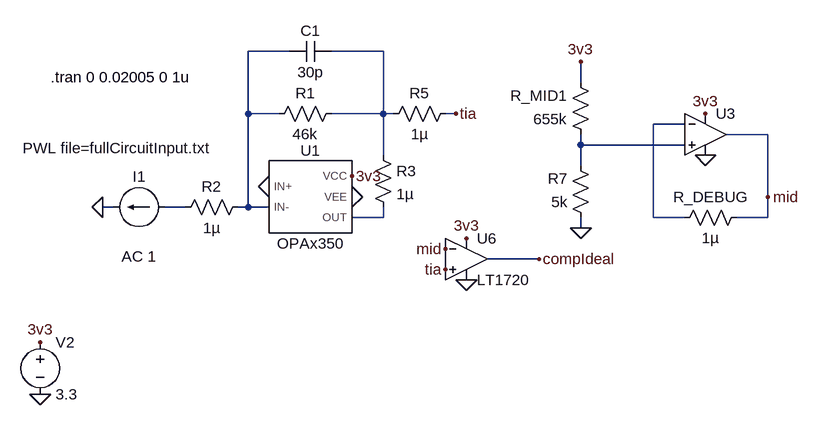
[diagram p0: schematic circuit_Simple.asc]
circuit_Simple.asc, the LTspice schematic file:
Version 4.1
SHEET 1 3920 1676
WIRE 2352 800 2288 800
WIRE 2496 800 2416 800
WIRE 2800 848 2800 816
WIRE 2288 896 2288 800
WIRE 2336 896 2288 896
WIRE 2496 896 2496 800
WIRE 2496 896 2416 896
WIRE 2512 896 2496 896
WIRE 2608 896 2592 896
WIRE 2960 912 2912 912
WIRE 3088 928 3024 928
WIRE 2800 944 2800 928
WIRE 2960 944 2800 944
WIRE 2496 960 2496 896
WIRE 2800 976 2800 944
WIRE 3088 1024 3088 928
WIRE 2080 1040 2064 1040
WIRE 2192 1040 2160 1040
WIRE 2288 1040 2288 896
WIRE 2288 1040 2272 1040
WIRE 2320 1040 2288 1040
WIRE 2496 1056 2496 1040
WIRE 2496 1056 2448 1056
WIRE 2912 1056 2912 912
WIRE 2960 1056 2912 1056
WIRE 3088 1056 3088 1024
WIRE 3088 1056 3040 1056
WIRE 2800 1072 2800 1056
WIRE 2736 1120 2656 1120
FLAG 2448 992 3v3
FLAG 2448 1024 0
FLAG 2064 1040 0
FLAG 1968 1328 0
FLAG 1968 1248 3v3
FLAG 2320 1008 0
FLAG 2608 896 tia
FLAG 2592 1104 mid
FLAG 2592 1136 tia
FLAG 2624 1088 3v3
FLAG 2624 1152 0
FLAG 2736 1120 compIdeal
FLAG 2800 1072 0
FLAG 2800 816 3v3
FLAG 2992 896 3v3
FLAG 2992 960 0
FLAG 3088 1024 mid
SYMBOL res 2432 880 R90
WINDOW 0 0 56 VBottom 2
WINDOW 3 32 56 VTop 2
SYMATTR InstName R1
SYMATTR Value 46k
SYMBOL cap 2416 784 R90
WINDOW 0 0 32 VBottom 2
WINDOW 3 32 32 VTop 2
SYMATTR InstName C1
SYMATTR Value 30p
SYMBOL res 2288 1024 R90
WINDOW 0 0 56 VBottom 2
WINDOW 3 32 56 VTop 2
SYMATTR InstName R2
SYMATTR Value 1µ
SYMBOL current 2160 1040 R90
WINDOW 0 -32 40 VBottom 2
WINDOW 3 -107 75 VTop 2
WINDOW 123 60 40 VTop 2
WINDOW 39 0 0 Left 0
SYMATTR InstName I1
SYMATTR Value PWL file=fullCircuitInput.txt
SYMATTR Value2 AC 1
SYMBOL LTSpiceModels\\sbom071e\\OPAx350 2384 1024 R0
SYMATTR InstName U1
SYMBOL voltage 1968 1232 R0
WINDOW 123 0 0 Left 0
WINDOW 39 0 0 Left 0
SYMATTR InstName V2
SYMATTR Value 3.3
SYMBOL Comparators\\LT1720 2624 1056 R0
SYMATTR InstName U6
SYMBOL res 2608 880 R90
WINDOW 0 0 56 VBottom 2
WINDOW 3 32 56 VTop 2
SYMATTR InstName R5
SYMATTR Value 1µ
SYMBOL res 2816 944 R180
WINDOW 0 36 76 Left 2
WINDOW 3 36 40 Left 2
SYMATTR InstName R_MID1
SYMATTR Value 655k
SYMBOL res 2816 1072 R180
WINDOW 0 36 76 Left 2
WINDOW 3 36 40 Left 2
SYMATTR InstName R7
SYMATTR Value 5k
SYMBOL res 3056 1040 R90
WINDOW 0 0 56 VBottom 2
WINDOW 3 32 56 VTop 2
SYMATTR InstName R_DEBUG
SYMATTR Value 1µ
SYMBOL OpAmps\\UniversalOpAmp2 2992 928 R0
SYMATTR InstName U3
SYMBOL res 2480 944 R0
SYMATTR InstName R3
SYMATTR Value 1µ
TEXT 1984 840 Left 2 !.tran 0 0.02005 0 1u

The netlist it stands for:
* circuit_Simple.asc
R1 N002 N001 46k
C1 N002 N001 30p
R2 N001 N005 1µ
I1 N005 0 PWL file=fullCircuitInput.txt AC 1
X§U1 0 N001 3v3 0 N006 OPAx350  ; pins IN+ IN- VCC VEE OUT
V2 3v3 0 3.3
X§U6 tia mid 3v3 0 compIdeal LT1720  ; pins In+ In- V+ V- OUT
R5 tia N002 1µ
R_MID1 N004 3v3 655k
R7 0 N004 5k
R_DEBUG mid N003 1µ
X§U3 N004 N003 3v3 0 mid level2 Avol=1Meg GBW=10Meg Slew=10Meg Ilimit=25m Rail=0 Vos=0 En=0 Enk=0 In=0 Ink=0 Rin=500Meg  ; pins In+ In- V+ V- OUT
R3 N002 N006 1µ
.tran 0 0.02005 0 1u
.lib C:\Users\jpulu\OneDrive\Área de Trabalho\TCC\LTSpiceModels\sbom071e\OPAx350.LIB
.lib LT1720.sub
.lib UniversalOpAmp2.lib
.backanno
.end